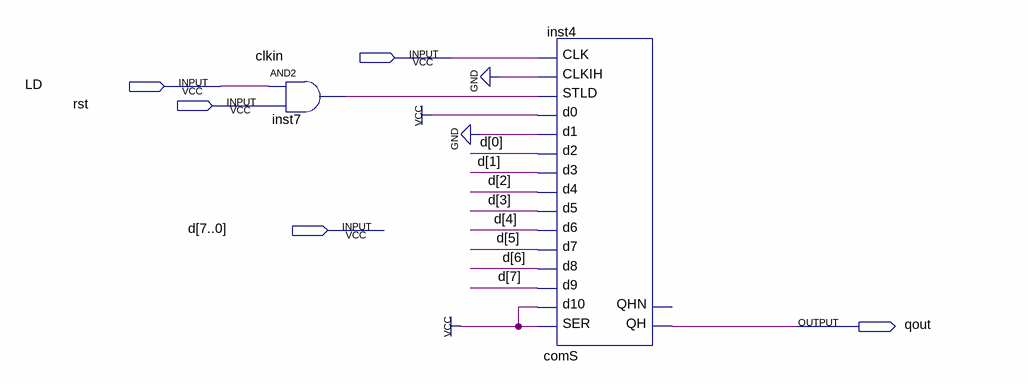
[diagram p0: schematic sheet]
// Quartus schematic comt.bdf as structural Verilog: 2 symbols, 5 pins
module comt (
  input  clkin,
  input  LD,
  input  rst,
  input  [7:0] d,
  output qout
);

  wire inst7_out;

  and inst7 (inst7_out, LD, rst);
  comS inst4 (
    .SER(1'b1), .d10(1'b1), .d9(d[7]), .d8(d[6]), .d7(d[5]), .d6(d[4]), .d5(d[3]), .d4(d[2]), .d3(d[1]),
    .d2(d[0]), .d1(1'b0), .d0(1'b1), .STLD(inst7_out), .CLKIH(1'b0), .CLK(clkin), .QH(qout));  // open: QHN
endmodule
